# EAGLE design samtec to dsub (EAGLE 9.4.1)
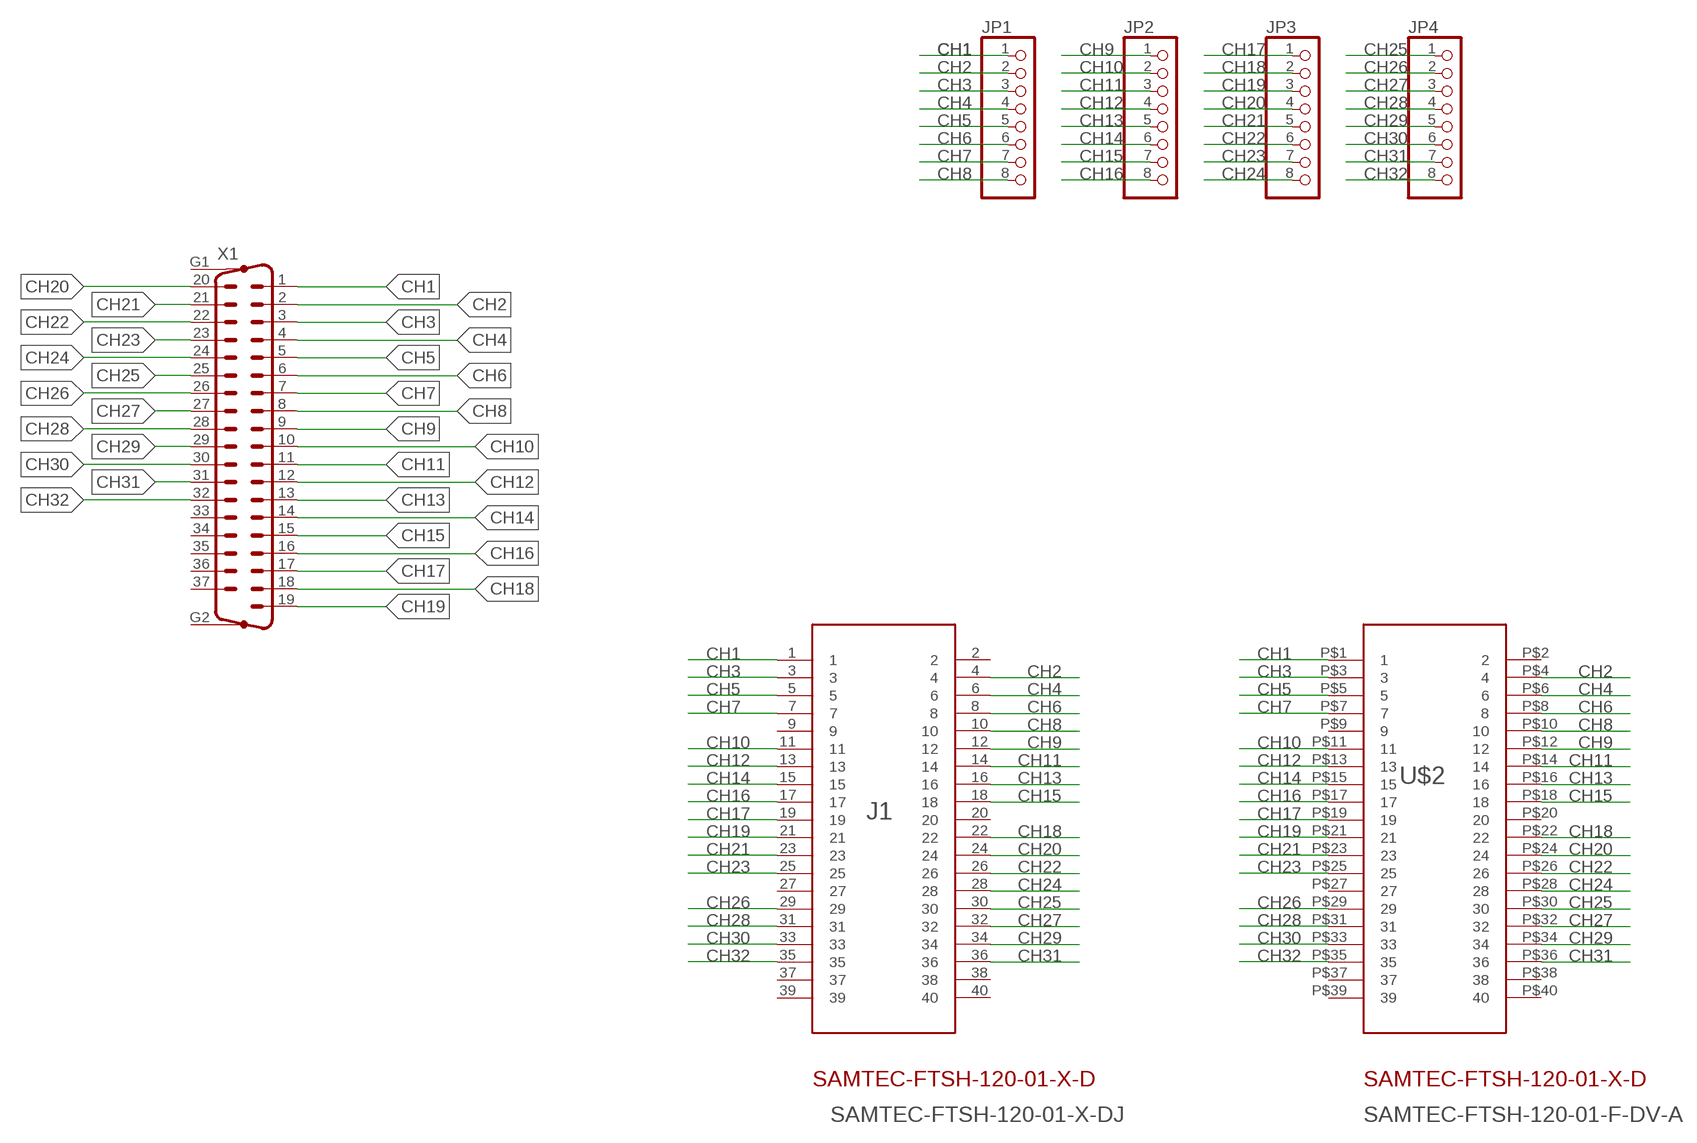
[diagram p0: schematic, sheet 1]

## Parts
J1  SAMTEC-FTSH-120-01-X-DJ  [SAMTEC-FTSH-120-01-X-D]
JP1  PINHD-1X8  [1X08]
JP2  PINHD-1X8  [1X08]
JP3  PINHD-1X8  [1X08]
JP4  PINHD-1X8  [1X08]
U$2  SAMTEC-FTSH-120-01-F-DV-A  [SAMTEC-FTSH-LARGEPAD]
X1  M37HP  [M37HP]

## Nets
CH1: J1.1 JP1.1 U$2.P$1 X1.1
CH2: J1.4 JP1.2 U$2.P$4 X1.2
CH3: J1.3 JP1.3 U$2.P$3 X1.3
CH4: J1.6 JP1.4 U$2.P$6 X1.4
CH5: J1.5 JP1.5 U$2.P$5 X1.5
CH6: J1.8 JP1.6 U$2.P$8 X1.6
CH7: J1.7 JP1.7 U$2.P$7 X1.7
CH8: J1.10 JP1.8 U$2.P$10 X1.8
CH9: J1.12 JP2.1 U$2.P$12 X1.9
CH10: J1.11 JP2.2 U$2.P$11 X1.10
CH11: J1.14 JP2.3 U$2.P$14 X1.11
CH12: J1.13 JP2.4 U$2.P$13 X1.12
CH13: J1.16 JP2.5 U$2.P$16 X1.13
CH14: J1.15 JP2.6 U$2.P$15 X1.14
CH15: J1.18 JP2.7 U$2.P$18 X1.15
CH16: J1.17 JP2.8 U$2.P$17 X1.16
CH17: J1.19 JP3.1 U$2.P$19 X1.17
CH18: J1.22 JP3.2 U$2.P$22 X1.18
CH19: J1.21 JP3.3 U$2.P$21 X1.19
CH20: J1.24 JP3.4 U$2.P$24 X1.20
CH21: J1.23 JP3.5 U$2.P$23 X1.21
CH22: J1.26 JP3.6 U$2.P$26 X1.22
CH23: J1.25 JP3.7 U$2.P$25 X1.23
CH24: J1.28 JP3.8 U$2.P$28 X1.24
CH25: J1.30 JP4.1 U$2.P$30 X1.25
CH26: J1.29 JP4.2 U$2.P$29 X1.26
CH27: J1.32 JP4.3 U$2.P$32 X1.27
CH28: J1.31 JP4.4 U$2.P$31 X1.28
CH29: J1.34 JP4.5 U$2.P$34 X1.29
CH30: J1.33 JP4.6 U$2.P$33 X1.30
CH31: J1.36 JP4.7 U$2.P$36 X1.31
CH32: J1.35 JP4.8 U$2.P$35 X1.32
Unconnected: J1.2 J1.9 J1.20 J1.27 J1.37 J1.38 J1.39 J1.40 U$2.P$2 U$2.P$9 U$2.P$20 U$2.P$27 U$2.P$37 U$2.P$38 U$2.P$39 U$2.P$40 X1.33 X1.34 X1.35 X1.36 X1.37 X1.G1 X1.G2

## Library data of the parts
J1 = SAMTEC-FTSH-120-01-X-D:SAMTEC-FTSH-120-01-X-D
JP1-JP4 = pinhead:PINHD-1X8: PIN HEADER
U$2 = samtec to dsub:SAMTEC-FTSH-120-01-F-DV-A
X1 = con-subd:M37HP: SUB-D; OC_FARNELL: unknown; OC_NEWARK: unknown

## Board
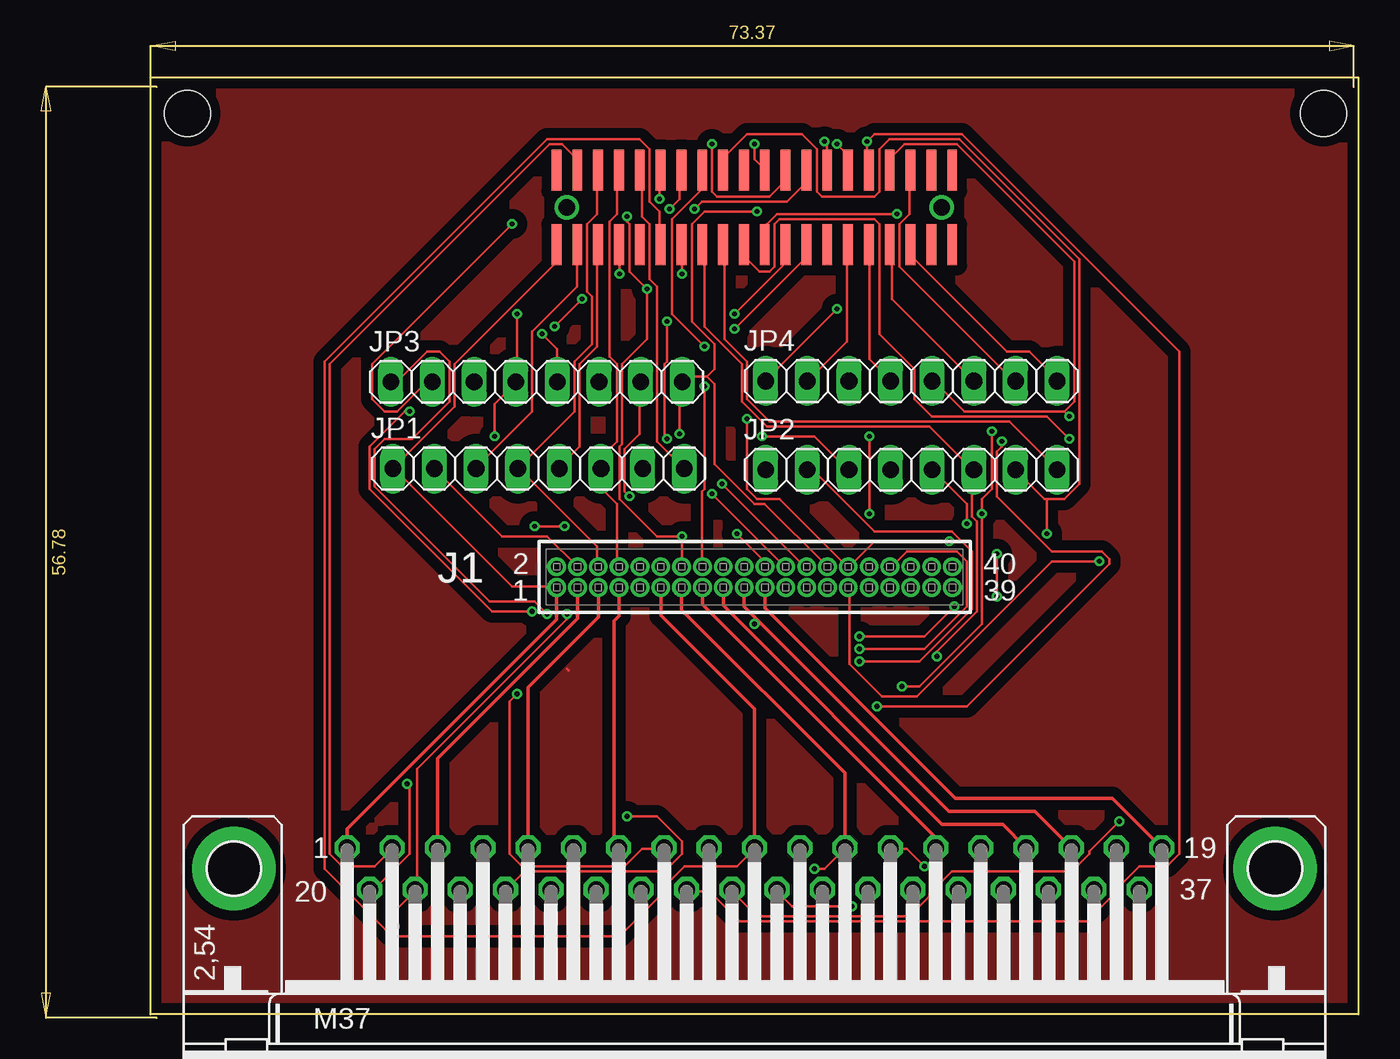
[diagram p1: board, top side]
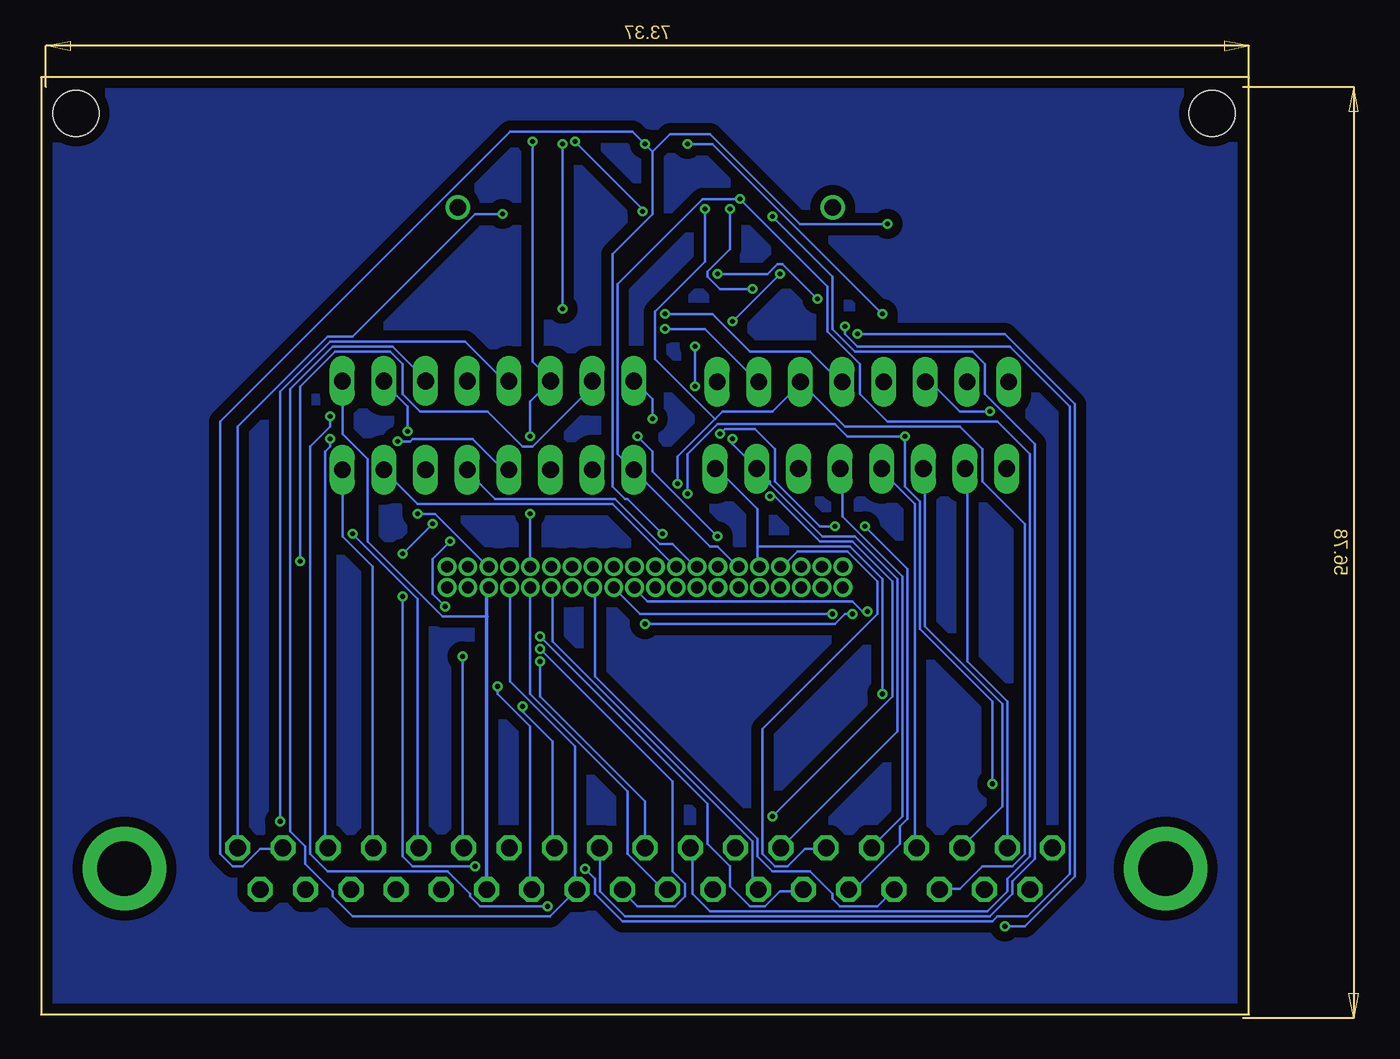
[diagram p2: board, bottom side, seen from below]

Size 73.66 x 57.15 mm. Coordinates in mm from the lower left corner, seen from the top.
Outline: 0,0 0,57.15 73.66,57.15 73.66,0 0,0
Copper layers (1*16): Top 0.035mm / dielectric 1.5mm / Bottom 0.035mm
Design rules "SparkFun-2-layer-PCBWay-LIMIT": minimum track width 6mil, minimum drill 0.3mm, track to track 6mil, track to pad 6mil, pad to pad 6mil, via to via 6mil, smd to smd 6mil, copper to edge 6mil, drill to drill 6mil, minimum pad ring 6mil, minimum via ring 6mil, stop-mask expansion 4mil, vias tented up to drill 25mil, thermal gap 10mil
Holes 2.8 mm at 2.24,54.95 71.52,54.95

### Footprints (pad centres in the part's own frame; a part is rotated, then mirrored left to right if it is on the bottom)
SAMTEC-FTSH-120-01-X-D = drill 0.71 pad 1.143: 1 -12.065,-0.635; 2 -12.065,0.635; 3 -10.795,-0.635; 4 -10.795,0.635; 5 -9.525,-0.635; 6 -9.525,0.635; 7 -8.255,-0.635; 8 -8.255,0.635; 9 -6.985,-0.635; 10 -6.985,0.635; 11 -5.715,-0.635; 12 -5.715,0.635; 13 -4.445,-0.635; 14 -4.445,0.635; 15 -3.175,-0.635; 16 -3.175,0.635; 17 -1.905,-0.635; 18 -1.905,0.635; 19 -0.635,-0.635; 20 -0.635,0.635; 21 0.635,-0.635; 22 0.635,0.635; 23 1.905,-0.635; 24 1.905,0.635; 25 3.175,-0.635; 26 3.175,0.635; 27 4.445,-0.635; 28 4.445,0.635; 29 5.715,-0.635; 30 5.715,0.635; 31 6.985,-0.635; 32 6.985,0.635; 33 8.255,-0.635; 34 8.255,0.635; 35 9.525,-0.635; 36 9.525,0.635; 37 10.795,-0.635; 38 10.795,0.635; 39 12.065,-0.635; 40 12.065,0.635
1X08 = drill 1.016 long: 1 -8.89,0; 2 -6.35,0; 3 -3.81,0; 4 -1.27,0; 5 1.27,0; 6 3.81,0; 7 6.35,0; 8 8.89,0
SAMTEC-FTSH-LARGEPAD = smd 0.6 x 2.5: P$1 -12.078,-2.249; P$2 -12.078,2.301; P$3 -10.808,-2.249; P$4 -10.808,2.301; P$5 -9.538,-2.249; P$6 -9.538,2.301; P$7 -8.268,-2.249; P$8 -8.268,2.301; P$9 -6.998,-2.249; P$10 -6.998,2.301; P$11 -5.728,-2.249; P$12 -5.728,2.301; P$13 -4.458,-2.249; P$14 -4.458,2.301; P$15 -3.188,-2.249; P$16 -3.188,2.301; P$17 -1.918,-2.249; P$18 -1.918,2.301; P$19 -0.648,-2.249; P$20 -0.648,2.301; P$21 0.622,-2.249; P$22 0.622,2.301; P$23 1.892,-2.249; P$24 1.892,2.301; P$25 3.162,-2.249; P$26 3.162,2.301; P$27 4.432,-2.249; P$28 4.432,2.301; P$29 5.702,-2.249; P$30 5.702,2.301; P$31 6.972,-2.249; P$32 6.972,2.301; P$33 8.242,-2.249; P$34 8.242,2.301; P$35 9.512,-2.249; P$36 9.512,2.301; P$37 10.782,-2.249; P$38 10.782,2.301; P$39 12.052,-2.249; P$40 12.052,2.301 | drill 1: P$41 -11.443,0.026; P$42 11.417,0.026
M37HP = drill 1.016 octagon: 1 -24.841,1.27; 2 -22.098,1.27; 3 -19.329,1.27; 4 -16.561,1.27; 5 -13.818,1.27; 6 -11.049,1.27; 7 -8.28,1.27; 8 -5.512,1.27; 9 -2.769,1.27; 10 0,1.27; 11 2.769,1.27; 12 5.512,1.27; 13 8.28,1.27; 14 11.049,1.27; 15 13.792,1.27; 16 16.561,1.27; 17 19.329,1.27; 18 22.073,1.27; 19 24.841,1.27; 20 -23.47,-1.27; 21 -20.701,-1.27; 22 -17.958,-1.27; 23 -15.189,-1.27; 24 -12.421,-1.27; 25 -9.652,-1.27; 26 -6.909,-1.27; 27 -4.14,-1.27; 28 -1.372,-1.27; 29 1.372,-1.27; 30 4.14,-1.27; 31 6.909,-1.27; 32 9.652,-1.27; 33 12.421,-1.27; 34 15.189,-1.27; 35 17.932,-1.27; 36 20.701,-1.27; 37 23.47,-1.27 | drill 3.302 pad 5.08: G1 -31.75,0; G2 31.75,0

### Placement (x,y rotation side)
J1  36.83,26.67 0 top
JP1  23.66,33.29 0 top
JP2  46.4,33.22 0 top
JP3  23.54,38.58 0 top
JP4  46.4,38.63 0 top
U$2  36.83,49.18 0 top
X1  36.83,8.89 0 top

### Tracks (layer width: path | path; a pad name or v marks a point on that pad's centre or on a via)
CH1
  Top 0.152: U$2.P$1 24.64,46.84 24.64,45.77 18.54,39.68 18.54,37.08 14.88,33.43 JP1.1 14.88,33.27 22.05,26.11 24.64,26.11 J1.1
  Top 0.203: J1.1 24.77,24.09 11.99,11.31 X1.1
CH2
  Top 0.152: J1.4 24.18,29.16 21.44,29.16 17.32,33.27 JP1.2 | U$2.P$4 26.01,51.56 26.01,52.17 25.1,53.09 24.33,53.09 10.92,39.68 10.92,9.8 11.68,9.04 13.67,9.04 14.73,10.11 X1.2
  Bottom 0.152: X1.2 14.73,19.1 17.17,21.54 17.17,33.27 JP1.2
CH3
  Top 0.152: U$2.P$3 26.01,46.84 26.01,44.4 23.27,41.66 23.27,36.78 19.91,33.43 JP1.3
  Top 0.203: J1.3 26.04,24.16 17.5,15.62 X1.3
  Bottom 0.152: JP1.3 19.76,33.27 19.76,23.67 15.04,18.95 15.04,12.7 17.47,10.26 X1.3
CH4
  Top 0.152: J1.6 27.23,27.33 27.23,28.55 22.5,33.27 JP1.4 22.5,33.43 25.86,36.78 25.86,39.83 26.92,40.89 26.92,43.79 26.62,44.09 26.62,48.21 27.23,48.82 27.23,51.41 U$2.P$6
  Bottom 0.152: X1.4 20.37,10.26 20.37,31.14 22.5,33.27 JP1.4
CH5
  Top 0.152: U$2.P$5 27.23,46.84 27.23,40.74 26.16,39.68 26.16,34.65 24.94,33.43 JP1.5
  Top 0.203: X1.5 23.01,19.93 27.31,24.23 J1.5
  Bottom 0.152: JP1.5 24.79,33.27 24.79,30.38 21.13,26.72 21.13,12.09 22.96,10.26 X1.5
CH6
  Top 0.152: J1.8 28.45,27.33 28.45,31.14 27.53,32.05 27.53,33.27 JP1.6 27.53,33.43 27.53,34.04 28.45,34.95 28.45,39.68 27.99,40.13 27.99,48.36 28.45,48.82 28.45,51.41 U$2.P$8
  Bottom 0.152: X1.6 25.86,10.11 27.08,10.11 28.14,9.04 28.9,9.04 29.67,9.8 29.67,17.42 22.66,24.44 22.66,26.42 24.49,28.24 27.53,28.24 28.45,27.33 J1.8
CH7  (via drill 0.3)
  Top 0.152: v28.6,45.16 28.6,46.84 U$2.P$7 | v31.5,42.27 31.5,39.83 31.34,39.68 31.34,35.26 v31.5,35.1
  Top 0.203: J1.7 28.57,24.3 28.27,23.99 28.27,10.44 X1.7
  Bottom 0.152: v31.5,42.27 v28.6,45.16 | v31.5,35.1 31.5,34.8 30.12,33.43 JP1.7 29.97,33.27 29.21,32.51 29.21,32.36 26.01,29.16 24.03,29.16 21.44,26.57 21.44,17.27 X1.7
CH8  (via drill 0.3)
  Top 0.152: U$2.P$10 29.97,51.41 29.97,48.67 30.43,48.21 30.43,44.86 30.89,44.4 30.89,34.95 32.41,33.43 JP1.8 | v22.35,19.56 21.89,19.1 21.89,9.8 22.66,9.04 28.9,9.04 29.97,10.11 31.19,10.11 X1.8
  Bottom 0.152: 29.97,28.55 29.97,30.84 32.41,33.27 JP1.8 | 29.97,28.55 29.97,27.33 J1.10 | v22.35,19.56 22.35,26.57 24.33,28.55 29.97,28.55
CH9  (via drill 0.3)
  Top 0.152: v31.04,49.73 31.04,51.41 U$2.P$12
  Bottom 0.152: J1.12 31.19,27.33 32.41,28.55 32.87,28.55 37.44,33.12 JP2.1 37.59,33.27 38.51,34.19 38.51,44.55 33.33,49.73 v31.04,49.73 25.71,44.4 25.71,41.66 23.72,39.68 23.72,37.85 22.05,36.17 15.34,36.17 13.36,34.19 13.36,9.65 14.73,8.28 14.73,7.52 15.95,6.3 32.87,6.3 33.93,7.37 33.93,10.11 X1.9
CH10  (via drill 0.3)
  Top 0.152: U$2.P$11 31.04,46.99 31.04,48.97 30.43,49.58 30.43,52.78 29.82,53.39 24.18,53.39 10.62,39.83 10.62,8.89 14.73,4.77 28.6,4.77 31.65,7.82 31.65,8.13 32.56,9.04 35.76,9.04 36.83,10.11 X1.10 | v43.23,21.54 46.89,21.54 50.09,24.74 50.09,28.24 48.87,29.46 44.15,29.46 40.49,33.12 40.18,33.12 JP2.2
  Top 0.203: J1.11 31.11,24.34 36.83,18.63 X1.10
  Bottom 0.152: v43.23,21.54 43.23,19.41 36.83,13.01 X1.10
CH11  (via drill 0.3)
  Top 0.152: v37.29,35.26 40.49,35.26 42.47,33.27 JP2.3 | J1.14 32.41,27.33 v32.41,29.16 30.89,29.16 28.6,31.45 28.6,34.65 28.75,34.8 28.75,39.68 30.28,41.2 v30.28,44.25 29.21,45.31 29.21,48.21 29.06,48.36 v29.06,48.67 | v31.65,49.12 32.26,49.73 32.26,51.41 U$2.P$14
  Bottom 0.152: v32.41,29.16 36.37,33.12 36.37,34.34 v37.29,35.26 | v31.65,49.12 31.65,46.68 33.02,45.31 33.02,45.01 32.26,44.25 v30.28,44.25 | v29.06,48.67 25.4,45.01 25.4,41.81 24.03,40.44 16.87,40.44 16.1,39.68 16.1,37.85 13.06,34.8 13.06,9.5 14.43,8.13 14.43,7.37 15.8,5.99 38.05,5.99 39.57,7.52 39.57,10.11 X1.11
CH12  (via drill 0.3)
  Top 0.152: v32.41,45.16 32.41,46.84 U$2.P$13 | v24.64,41.96 v26.31,43.64 | v40.49,8.89 41.1,8.89 42.32,10.11 X1.12 | v51.92,34.95 51.92,34.65 51.61,34.34 51.61,31.6 54.97,28.24 58.01,28.24 58.47,27.79 58.47,27.48 49.78,18.8 v44.3,18.8
  Top 0.203: J1.13 32.39,24.67 42.34,14.72 X1.12
  Bottom 0.152: v32.41,45.16 29.36,45.16 28.75,45.77 28.45,45.77 v26.31,43.64 | v24.64,41.96 24.64,41.5 23.88,40.74 14.58,40.74 10.92,37.08 10.92,8.59 13.51,5.99 15.34,5.99 15.65,5.69 38.2,5.69 39.88,7.37 39.88,8.28 v40.49,8.89 | v51.92,34.95 51.16,34.95 51,35.1 47.35,35.1 45.52,33.27 45.21,33.27 JP2.4 | v44.3,18.8 44.3,18.49 42.47,16.66 42.47,10.26 X1.12
CH13  (via drill 0.3)
  Top 0.152: v33.78,40.74 31.8,42.72 31.8,48.51 33.63,50.34 33.63,51.41 U$2.P$16 | v33.78,38.3 33.78,32.05 33.63,31.9 33.63,27.33 J1.16 | v47.19,9.04 46.13,10.11 45.21,10.11 X1.13 | v51.61,28.09 v51.61,25.5 | v49.78,29.92 49.78,31.14 47.8,33.12 JP2.5
  Bottom 0.152: J1.16 33.78,27.33 35.15,28.7 35.92,28.7 38.66,31.45 45.97,31.45 47.65,33.12 JP2.5 | v33.78,38.3 v33.78,40.74 | v47.19,9.04 51,9.04 51.61,9.65 v51.61,25.5 | v49.78,29.92 v51.61,28.09
CH14  (via drill 0.3)
  Top 0.152: U$2.P$15 33.78,46.84 33.78,41.96 36.07,39.68 36.07,37.39 37.59,35.87 47.5,35.87 50.09,33.27 JP2.6 50.09,33.12 50.09,30.38 50.39,30.07 50.39,24.59 47.95,22.15 v47.95,21.84
  Top 0.203: J1.15 33.66,25.01 47.88,10.78 X1.14
  Bottom 0.152: v47.95,21.84 47.95,10.26 X1.14
CH15  (via drill 0.3)
  Top 0.152: 54.66,31.45 54.51,31.45 52.83,33.12 JP2.7 | 54.66,31.45 55.73,31.45 56.64,32.36 56.64,46.08 49.33,53.39 45.06,53.39 44.45,52.78 44.45,50.19 44.15,49.89 40.95,49.89 40.64,50.19 40.64,52.78 39.73,53.7 36.37,53.7 35,52.32 35,51.56 U$2.P$18 | 54.66,31.45 v54.66,29.31
  Bottom 0.152: J1.18 35,27.33 38.81,31.14 50.7,31.14 52.68,33.12 JP2.7 | v54.66,29.31 50.7,25.35 50.7,10.26 X1.15
CH16
  Top 0.152: U$2.P$17 35,46.84 35,41.2 36.37,39.83 36.37,37.54 37.74,36.17 52.38,36.17 55.27,33.27 JP2.8
  Top 0.203: J1.17 34.92,24.94 48.27,11.59 51.96,11.59 X1.16
  Bottom 0.152: X1.16 53.44,10.26 53.44,27.33 55.27,29.16 55.27,33.12 JP2.8
CH17  (via drill 0.3)
  Top 0.152: v56.03,35.1 54.66,36.47 47.65,36.47 46.58,37.54 46.58,39.37 44.45,41.5 44.45,48.21 44.15,48.51 38.35,48.51 38.05,48.21 38.05,45.62 37.74,45.31 37.14,45.31 36.22,46.23 36.22,46.84 U$2.P$19 | v24.18,24.44 23.42,25.2 20.68,25.2 13.67,32.21 13.67,34.49 14.28,35.1 15.95,35.1 18.24,37.39 18.24,39.83 17.63,40.44 16.87,40.44 15.04,38.61 14.73,38.61 JP3.1 | 37.03,24.03 v36.83,23.82
  Top 0.203: J1.19 36.2,24.87 37.03,24.03 48.67,12.39 53.93,12.39 X1.17
  Bottom 0.152: v56.03,35.1 56.03,34.65 56.34,34.34 56.34,10.41 56.19,10.26 X1.17 | v24.18,24.44 24.64,24.44 25.25,23.82 v36.83,23.82
CH18  (via drill 0.3)
  Top 0.152: v35.76,29.31 37.44,27.63 37.44,27.33 J1.22 | v36.83,53.09 36.83,52.17 37.44,51.56 U$2.P$22 | v22.05,48.21 13.51,39.68 13.51,37.54 14.28,36.78 15.04,36.78 16.71,38.46 17.17,38.46 JP3.2
  Bottom 0.152: v35.76,29.31 37.9,31.45 38.05,31.45 38.81,32.21 38.81,46.38 36.37,48.82 36.37,52.63 | 36.37,52.63 v36.83,53.09 37.59,53.85 45.06,53.85 62.74,36.17 62.74,9.8 61.98,9.04 61.37,9.04 60.3,10.11 58.93,10.11 X1.18 | v22.05,48.21 27.38,48.21 32.87,53.7 35.31,53.7 36.37,52.63
CH19  (via drill 0.3)
  Top 0.152: v45.52,48.82 38.2,48.82 37.59,48.21 37.59,46.99 U$2.P$21 | v15.8,36.78 15.49,36.78 13.36,34.65 13.36,32.05 20.83,24.59 v23.27,24.59
  Top 0.203: J1.21 37.47,24.8 49.07,13.19 58.64,13.19 X1.19
  Bottom 0.152: v45.52,48.82 47.19,48.82 54.66,41.35 56.19,41.35 61.67,35.87 X1.19 | v15.8,36.78 17.63,36.78 19.3,38.46 19.61,38.46 JP3.3 | v23.27,24.59 23.57,24.59 24.18,25.2 36.68,25.2 37.44,25.96 J1.21
CH20  (via drill 0.3)
  Top 0.152: v34.24,31.75 38.66,27.33 J1.24 | v20.98,35.26 20.98,37.24 22.2,38.46 JP3.4 22.35,38.61 v22.35,42.72 | v34.24,53.09 34.24,50.19 34.54,49.89 37.74,49.89 38.66,50.8 38.66,51.41 U$2.P$24 | v15.65,14.07 15.8,13.92 15.8,9.8 13.67,7.67 13.36,7.67 X1.20
  Bottom 0.152: v34.24,31.75 34.24,34.19 32.41,36.02 25.25,36.02 24.49,35.26 v20.98,35.26 20.98,32.21 20.07,31.29 20.07,23.52 15.65,19.1 v15.65,14.07 | v34.24,53.09 32.72,53.09 v22.35,42.72
CH21  (via drill 0.3)
  Top 0.152: v35.61,42.72 38.66,45.77 38.66,46.84 U$2.P$23 | v25.4,24.44 25.4,24.13 16.26,14.99 16.26,7.67 X1.21 16.1,7.52 14.88,6.3 v14.88,5.38 | v23.88,41.5 24.79,40.59 24.79,38.61 JP3.5
  Bottom 0.152: v35.61,42.72 32.72,42.72 30.43,40.44 26.77,40.44 24.94,38.61 JP3.5 | J1.23 37.14,24.44 v25.4,24.44 | v23.88,41.5 14.88,41.5 10.62,37.24 10.62,8.43 13.67,5.38 v14.88,5.38
CH22  (via drill 0.3)
  Top 0.152: v34.85,32.36 39.88,27.33 J1.26 | v33.17,49.12 33.63,49.58 38.81,49.58 39.88,50.65 39.88,51.41 U$2.P$26
  Bottom 0.152: v34.85,32.36 34.85,34.04 32.56,36.32 | 32.56,36.32 32.11,36.78 29.06,36.78 27.38,38.46 JP3.6 27.23,38.46 24.64,35.87 17.63,35.87 16.26,34.49 16.26,32.51 13.67,29.92 13.67,9.8 14.43,9.04 16.26,9.04 17.63,7.67 18.85,7.67 X1.22 | v33.17,49.12 33.17,45.92 36.22,42.87 36.22,39.98 32.56,36.32
CH23  (via drill 0.3)
  Top 0.152: v35.61,41.81 39.88,46.08 39.88,46.84 U$2.P$25 | v29.21,31.6 28.9,31.9 28.9,34.49 29.82,35.41 29.82,38.46 JP3.7 | v29.06,12.09 30.89,12.09 32.41,10.57 32.41,9.8 31.34,8.74 22.81,8.74 21.74,7.67 X1.23
  Bottom 0.152: v35.61,41.81 33.17,41.81 29.97,38.61 JP3.7 | X1.23 22.66,6.6 24.94,6.6 25.4,7.06 25.4,7.37 26.77,8.74 29.06,8.74 29.97,9.65 29.97,10.72 39.88,20.62 39.88,25.96 J1.25 | v29.21,31.6 28.9,31.6 26.16,28.85 24.18,28.85 21.74,26.42 21.74,19.41 v29.06,12.09
CH24  (via drill 0.3)
  Top 0.152: J1.28 37.44,31.14 36.83,31.14 34.39,33.58 34.39,38.46 33.93,38.91 | 33.93,38.91 32.87,38.91 32.56,38.61 JP3.8 32.41,38.46 32.26,38.3 v32.26,35.41 | v41.1,53.24 41.25,53.09 41.25,51.56 U$2.P$28 | v36.98,48.97 33.78,48.97 33.02,48.21 33.02,42.27 34.39,40.89 34.39,39.37 33.93,38.91 | v25.25,29.77 v23.42,29.77
  Bottom 0.152: v41.1,53.24 36.98,49.12 v36.98,48.97 | v23.42,29.77 20.83,27.18 20.83,11.94 21.29,11.48 21.29,10.41 24.03,7.67 24.33,7.67 X1.24 | v25.25,29.77 26.16,29.77 28.9,32.51 28.9,34.49 30.12,35.71 31.95,35.71 v32.26,35.41
CH25  (via drill 0.3)
  Top 0.152: v36.37,36.32 36.37,32.05 36.98,31.45 38.35,31.45 42.47,27.33 J1.30 42.62,27.33 44.15,28.85 v48.72,28.85 | v41.86,53.09 42.47,52.48 42.47,51.56 U$2.P$30 | v41.86,43.03 37.59,38.76 JP4.1 | v43.23,23.06 47.19,23.06 v49.02,24.89
  Bottom 0.152: v36.37,36.32 36.37,37.54 37.44,38.61 JP4.1 | v41.86,43.03 v41.86,53.09 | v43.23,23.06 33.02,12.85 33.02,10.41 31.65,9.04 31.65,7.82 30.43,6.6 29.52,6.6 28.6,7.52 27.23,7.52 X1.25 | v49.02,24.89 49.78,25.65 49.78,27.79 v48.72,28.85
CH26  (via drill 0.3)
  Top 0.152: U$2.P$29 42.47,46.84 42.47,41.05 40.18,38.76 JP4.2 | v57.86,27.63 54.97,27.63 46.74,19.41 44.6,19.41 42.62,21.39 42.62,25.96 J1.29
  Bottom 0.152: X1.26 30.28,7.98 30.28,10.57 42.47,22.76 42.47,25.96 J1.29 | v57.86,27.63 57.86,38.3 55.73,40.44 52.38,40.44 51.61,39.68 51.61,37.85 50.55,36.78 46.43,36.78 44.3,34.65 43.69,34.65 40.18,38.15 40.18,38.61 JP4.2
CH27  (via drill 0.3)
  Top 0.152: v43.84,35.26 v43.84,30.53 | U$2.P$32 43.69,51.56 v43.69,53.24 44.15,53.7 49.48,53.7 62.74,40.44 62.74,9.8 61.98,9.04 60.3,9.04 59.23,7.98 59.23,7.82 57.1,5.69 35.92,5.69 34.09,7.52 32.72,7.52 X1.27
  Bottom 0.152: v43.84,30.53 43.84,27.33 J1.32 | v43.84,35.26 43.84,37.39 42.62,38.61 JP4.3 42.62,38.76 43.69,39.83 v43.69,53.24
CH28  (via drill 0.3)
  Top 0.152: U$2.P$31 43.84,46.84 43.84,39.98 45.06,38.76 JP4.4 | v59.08,11.79 57.25,9.96 57.25,9.8 56.19,8.74 48.87,8.74 47.5,7.37 47.5,7.21 46.28,5.99 36.98,5.99 35.46,7.52 X1.28
  Bottom 0.152: J1.31 43.84,25.96 43.84,19.56 37.9,13.61 37.9,9.8 35.76,7.67 35.46,7.67 X1.28 | v59.08,11.79 59.08,38 56.03,41.05 47.8,41.05 45.52,38.76 45.21,38.76 JP4.4
CH29  (via drill 0.3)
  Top 0.152: 55.73,36.78 56.34,37.39 56.34,45.92 49.17,53.09 45.97,53.09 45.21,52.32 45.21,51.56 U$2.P$34 | 55.73,36.78 49.63,36.78 47.8,38.61 JP4.5 | v43.23,22.3 47.19,22.3 49.78,24.89 49.78,27.63 49.17,28.24 46.13,28.24 45.21,27.33 J1.34 | v56.03,36.47 55.73,36.78 | v42.77,6.6 39.12,6.6 38.2,7.52 X1.29
  Bottom 0.152: v43.23,22.3 35.15,14.22 35.15,8.74 34.39,7.98 34.39,7.21 35,6.6 37.29,6.6 38.2,7.52 X1.29 | v56.03,36.47 56.03,35.87 57.25,34.65 57.25,9.8 56.19,8.74 48.87,8.74 47.5,7.37 47.5,7.21 46.89,6.6 v42.77,6.6
CH30
  Top 0.152: U$2.P$33 45.21,46.84 45.21,43.64 50.09,38.76 JP4.6
  Bottom 0.152: J1.33 45.06,25.96 45.06,20.32 41.1,16.36 41.1,7.67 X1.30 41.1,7.52 42.62,5.99 54.66,5.99 55.88,7.21 55.88,7.52 57.56,9.2 57.56,10.26 58.47,11.18 58.47,38.15 55.88,40.74 52.22,40.74 50.24,38.76 JP4.6
CH31  (via drill 0.3)
  Top 0.152: v51.31,35.56 51.31,32.05 50.7,31.45 v50.7,30.53 50.7,23.82 46.89,20.02 v45.82,20.02 | U$2.P$36 46.28,51.41 46.28,48.82 45.67,48.21 45.67,45.62 52.68,38.61 JP4.7
  Bottom 0.152: v50.7,30.53 49.63,30.53 46.43,27.33 J1.36 | v51.31,35.56 51.31,37.08 52.83,38.61 JP4.7 | v45.82,20.02 45.82,19.56 43.84,17.58 43.84,7.67 X1.31
CH32
  Top 0.152: U$2.P$35 46.43,46.84 46.43,46.23 52.22,40.44 53.59,40.44 55.27,38.76 JP4.8
  Bottom 0.152: JP4.8 55.27,38.61 55.27,35.41 53.75,33.88 53.75,28.85 49.17,24.28 46.48,24.28 46.43,24.28
  Bottom 0.203: J1.35 46.48,25.91 46.48,24.28 X1.32
G
  pour Bottom (isolate 0.61): 0,56.7 73.97,56.7 73.97,0 0.12,0.06
N$1
  Top 0.152: 25.4,21.08 25.5,20.98
  pour Top (isolate 0.61): 0,57.15 73.79,57.15 73.79,0 0.02,0.06

### Text on the board
tPlace: Male d-sub
tDocu: d-sub to samtec / for actiCHamp
bDocu: 17 | 1 | 1 | 1